# Altium project 海关全向控制器视频采集卡转接板V4.PrjPcb
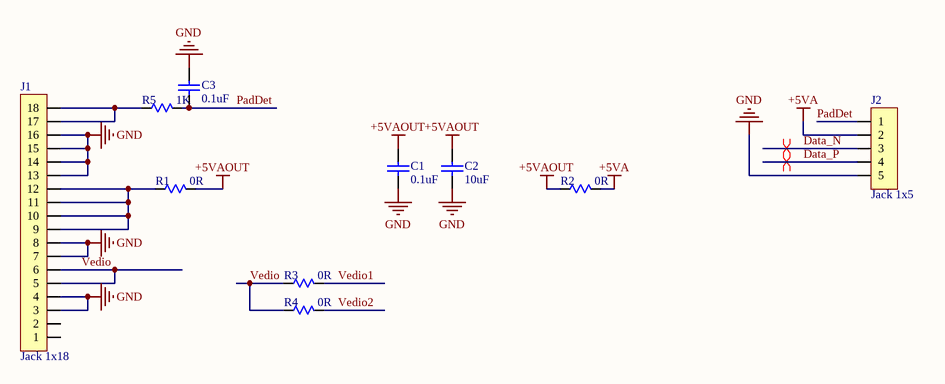
[diagram p0: 海关全向控制器视频采集卡转接板V4.SchDoc]
1 sheet, 10 parts. Net scope: global (net labels, ports and power ports of the same name join across sheets).
Board file: 海关全向控制器视频采集卡转接板V4.PcbDoc

## Sheet 海关全向控制器视频采集卡转接板V4.SchDoc
size A4

### Parts
C1  0.1uF  [C0805]
C2  10uF  [C0805]
C3  0.1uF  [C0805]
J1  Jack 1x18  [0.5S-6X-18PB]
J2  Jack 1x5  [35363-0560]
R1  0R  [R0805]
R2  0R  [R0805]
R3  0R  [R0805]
R4  0R  [R0805]
R5  1K  [R0805]

### Nets
+5VA: J2.2 R2.2
+5VAOUT: C1.2 C2.2 R1.2 R2.1
GND: C1.1 C2.1 C3.2 J1.3 J1.4 J1.7 J1.8 J1.13 J1.14 J1.15 J1.16 J2.5
Data_N: J2.3
Data_P: J2.4
PadDet: C3.1 J2.1 R5.2
Vedio: J1.5 J1.6 R3.1 R4.1
Vedio1: R3.2
Vedio2: R4.2
NetJ1_9: J1.9 J1.10 J1.11 J1.12 R1.1
NetJ1_17: J1.17 J1.18 R5.1

Not connected (* = marked no-connect by the designer): J1 1 2

### Layout directives
differential pair: Data_N, Data_P

### Notes on the sheet
- 文件名:
- 审核:
- 制图人:
- 孟浩
- 校对:
- 图号:
- 批准:
- 日期:

### Library data of the parts
C1-C3 = Cap Semi
J1 = Jack 1x18: 插座
J2 = Jack 1x5: 插座
R1-R5 = Res: Resistor; Published: 8-Jun-2000; LatestRevisionDate: 04-Mar-2005; LatestRevisionNote: PCB Footprint replaced.; PackageReference: J1-0603; Publisher: Altium Limited